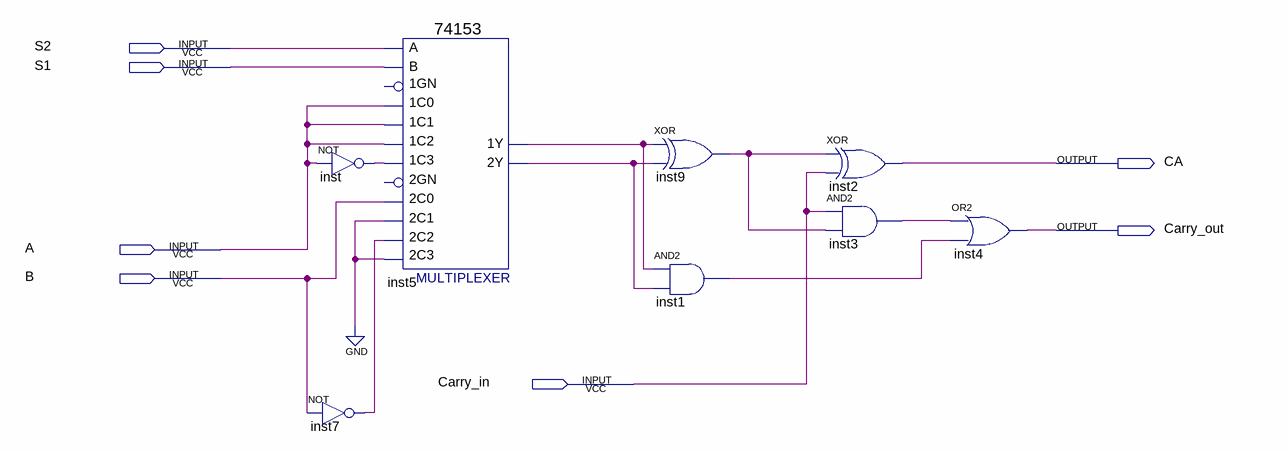
[diagram p0: schematic sheet]
// Quartus schematic fulladder1bit.bdf as structural Verilog: 8 symbols, 7 pins
module fulladder1bit (
  input  S2,
  input  S1,
  input  A,
  input  B,
  input  Carry_in,
  output CA,
  output Carry_out
);

  wire inst1_out, inst3_out, inst5_1y, inst5_2y, inst7_out, inst9_out, inst_out;

  not inst (inst_out, A);
  not inst7 (inst7_out, B);
  \74153  inst5 (
    .\1C1 (A), .\1C0 (A), .\2C0 (B), .\2C2 (inst7_out), .\1C2 (A), .\1C3 (inst_out), .B(S1), .A(S2),
    .\2C1 (1'b0), .\2C3 (1'b0), .\1Y (inst5_1y), .\2Y (inst5_2y));  // open: 1GN, 2GN
  xor inst9 (inst9_out, inst5_1y, inst5_2y);
  and inst1 (inst1_out, inst5_1y, inst5_2y);
  xor inst2 (CA, inst9_out, Carry_in);
  and inst3 (inst3_out, Carry_in, inst9_out);
  or inst4 (Carry_out, inst3_out, inst1_out);
endmodule
